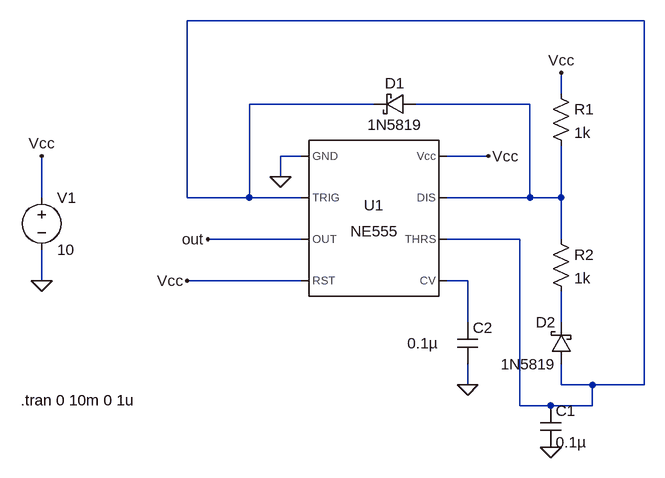
[diagram p0: schematic NE555TIMER.asc]
NE555TIMER.asc, the LTspice schematic file:
Version 4
SHEET 1 880 680
WIRE 624 -144 -80 -144
WIRE 496 -32 496 -64
WIRE 208 -16 16 -16
WIRE 448 -16 272 -16
WIRE 96 64 64 64
WIRE 384 64 320 64
WIRE 64 96 64 64
WIRE -304 128 -304 64
WIRE -80 128 -80 -144
WIRE 16 128 16 -16
WIRE 16 128 -80 128
WIRE 96 128 16 128
WIRE 448 128 448 -16
WIRE 448 128 320 128
WIRE 496 128 496 48
WIRE 496 128 448 128
WIRE 96 192 -48 192
WIRE 432 192 320 192
WIRE 496 192 496 128
WIRE -304 256 -304 208
WIRE 96 256 -80 256
WIRE 352 256 320 256
WIRE 352 320 352 256
WIRE 496 320 496 272
WIRE 352 416 352 384
WIRE 496 416 496 384
WIRE 544 416 496 416
WIRE 624 416 624 -144
WIRE 624 416 544 416
WIRE 432 448 432 192
WIRE 480 448 432 448
WIRE 544 448 544 416
WIRE 544 448 480 448
FLAG -304 64 Vcc
FLAG -304 256 0
FLAG -80 256 Vcc
FLAG 384 64 Vcc
FLAG 496 -64 Vcc
FLAG 64 96 0
FLAG 352 416 0
FLAG -48 192 out
FLAG 480 512 0
SYMBOL Misc\\NE555 208 160 R0
SYMATTR InstName U1
SYMBOL voltage -304 112 R0
WINDOW 123 0 0 Left 0
WINDOW 39 0 0 Left 0
SYMATTR InstName V1
SYMATTR Value 10
SYMBOL schottky 272 -32 R90
WINDOW 0 0 32 VBottom 2
WINDOW 3 32 32 VTop 2
SYMATTR InstName D1
SYMATTR Value 1N5819
SYMATTR Description Diode
SYMATTR Type diode
SYMBOL res 480 -48 R0
SYMATTR InstName R1
SYMATTR Value 1k
SYMBOL res 480 176 R0
SYMATTR InstName R2
SYMATTR Value 1k
SYMBOL schottky 512 384 R180
WINDOW 0 24 64 Left 2
WINDOW 3 24 0 Left 2
SYMATTR InstName D2
SYMATTR Value 1N5819
SYMATTR Description Diode
SYMATTR Type diode
SYMBOL cap 336 320 R0
WINDOW 3 -77 32 Left 2
SYMATTR InstName C2
SYMATTR Value 0.1µ
SYMBOL cap 464 448 R0
SYMATTR InstName C1
SYMATTR Value 0.1µ
TEXT -336 440 Left 2 !.tran 0 10m 0 1u

The netlist it stands for:
* NE555TIMER.asc
XU1 0 N001 out Vcc N003 N001 N002 Vcc NE555  ; pins GND TRIG OUT RST CV THRS DIS Vcc
V1 Vcc 0 10
D1 N002 N001 1N5819
R1 Vcc N002 1k
R2 N002 N004 1k
D2 N001 N004 1N5819
C2 N003 0 0.1µ
C1 N001 0 0.1µ
.model D D
.lib standard.dio
.tran 0 10m 0 1u
.lib NE555.sub
.backanno
.end